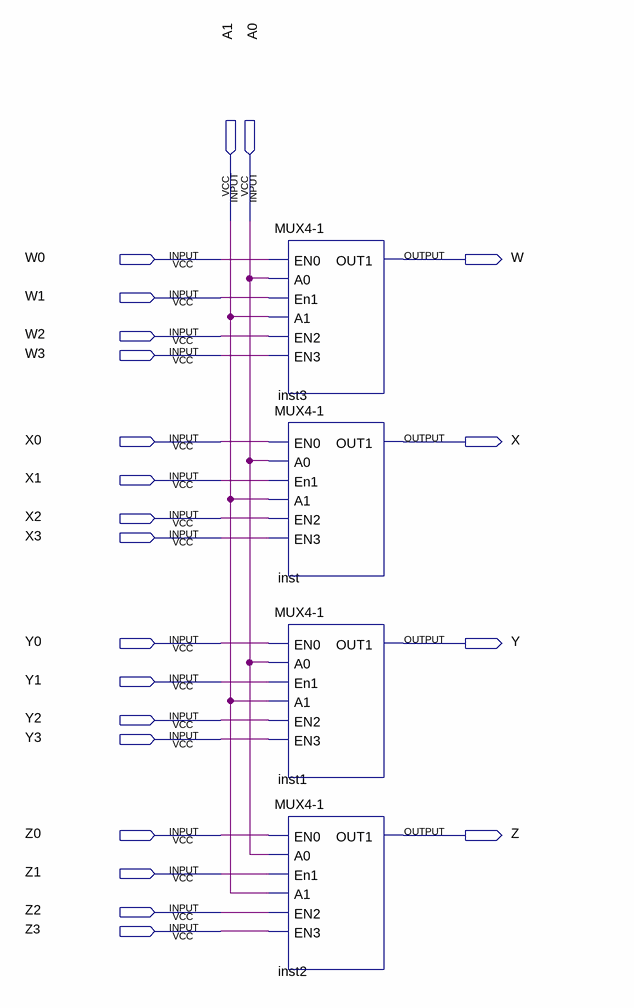
[diagram p0: schematic sheet]
// Quartus schematic MuliplexerQuad4-1.bdf as structural Verilog: 4 symbols, 22 pins
module \MuliplexerQuad4-1  (
  input  A1,
  input  A0,
  input  W0,
  input  W1,
  input  W2,
  input  W3,
  input  X0,
  input  X1,
  input  X2,
  input  X3,
  input  Y0,
  input  Y1,
  input  Y2,
  input  Y3,
  input  Z0,
  input  Z1,
  input  Z2,
  input  Z3,
  output W,
  output X,
  output Y,
  output Z
);

  \MUX4-1  inst3 (.EN0(W0), .A0(A0), .En1(W1), .A1(A1), .EN2(W2), .EN3(W3), .OUT1(W));
  \MUX4-1  inst (.EN0(X0), .A0(A0), .En1(X1), .A1(A1), .EN2(X2), .EN3(X3), .OUT1(X));
  \MUX4-1  inst1 (.EN0(Y0), .A0(A0), .En1(Y1), .A1(A1), .EN2(Y2), .EN3(Y3), .OUT1(Y));
  \MUX4-1  inst2 (.EN0(Z0), .A0(A0), .En1(Z1), .A1(A1), .EN2(Z2), .EN3(Z3), .OUT1(Z));
endmodule
